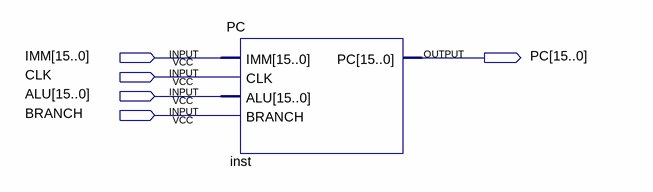
[diagram p0: schematic sheet]
// Quartus schematic test.bdf as structural Verilog: 1 symbols, 5 pins
module test (
  input  [15:0] IMM,
  input  CLK,
  input  [15:0] ALU,
  input  BRANCH,
  output [15:0] PC
);

  PC inst (.IMM(IMM), .CLK(CLK), .ALU(ALU), .BRANCH(BRANCH), .PC(PC));
endmodule
